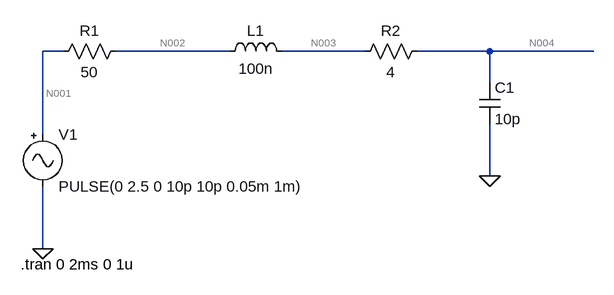
[diagram p0: schematic Lab 4 - Sec A #3A-Fig 2(a).asc]
Lab 4 - Sec A #3A-Fig 2(a).asc, the LTspice schematic file:
Version 4
SHEET 1 900 680
WIRE 48 16 16 16
WIRE 304 16 128 16
WIRE 512 16 384 16
WIRE 704 16 592 16
WIRE 864 16 704 16
WIRE 704 64 704 16
WIRE 16 144 16 16
WIRE 704 208 704 128
WIRE 16 320 16 224
FLAG 16 320 0
FLAG 704 208 0
SYMBOL res 144 0 R90
WINDOW 0 0 56 VBottom 2
WINDOW 3 32 56 VTop 2
SYMATTR InstName R1
SYMATTR Value 50
SYMBOL ind 288 32 R270
WINDOW 0 32 56 VTop 2
WINDOW 3 5 56 VBottom 2
SYMATTR InstName L1
SYMATTR Value 100n
SYMBOL res 608 0 R90
WINDOW 0 0 56 VBottom 2
WINDOW 3 32 56 VTop 2
SYMATTR InstName R2
SYMATTR Value 4
SYMBOL cap 688 64 R0
SYMATTR InstName C1
SYMATTR Value 10p
SYMBOL Misc\\signal 16 128 R0
WINDOW 123 0 0 Left 0
WINDOW 39 0 0 Left 0
SYMATTR InstName V1
SYMATTR Value PULSE(0 2.5 0 10p 10p 0.05m 1m)
TEXT -18 344 Left 2 !.tran 0 2ms 0 1u

The netlist it stands for:
* Lab 4 - Sec A #3A-Fig 2(a).asc
R1 N002 N001 50
L1 N002 N003 100n
R2 N004 N003 4
C1 N004 0 10p
V1 N001 0 PULSE(0 2.5 0 10p 10p 0.05m 1m)
.tran 0 2ms 0 1u
.backanno
.end

* Results of the author's LTspice run, read from the files saved beside the schematic
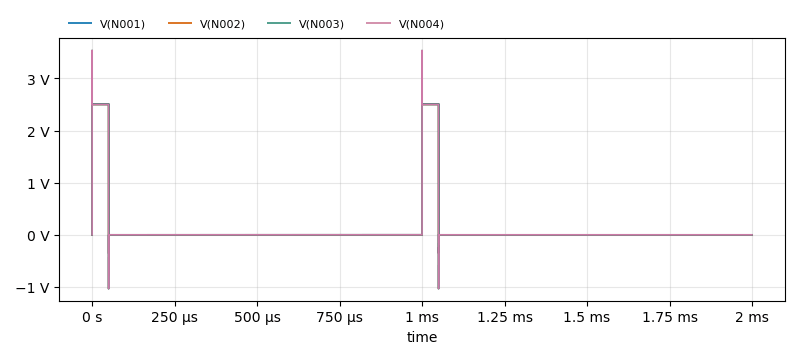
[diagram p1: Transient Analysis of Lab 4 - Sec A #3A-Fig 2(a).asc, plotted from the saved traces]
* Transient Analysis, 1 run:
*   V(N001): min 0 V, max 2.5 V, average 125 mV, rms 559 mV, last 0 V
*   V(N002): min -356 mV, max 2.846 V, average 125 mV, rms 559 mV, last 0 V
*   V(N003): min -1.035 V, max 3.537 V, average 125 mV, rms 559 mV, last 0 V
*   V(N004): min -1.034 V, max 3.534 V, average 125 mV, rms 559 mV, last 0 V